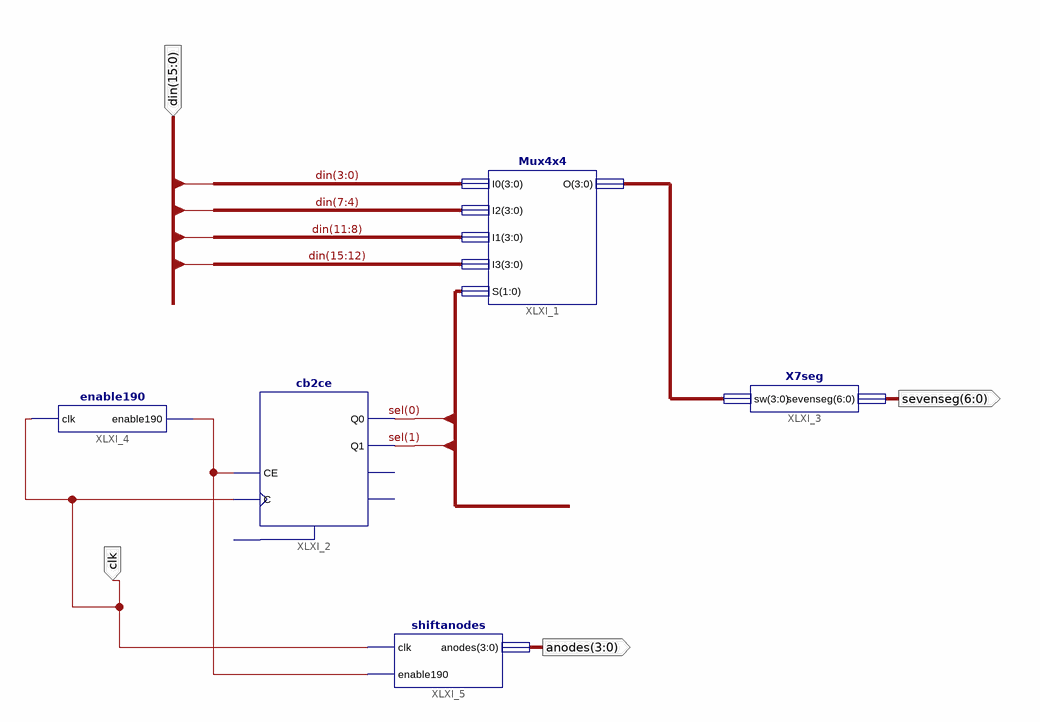
[diagram p0: schematic sheet 1]
// Xilinx ISE schematic afficheur.sch (spartan6) as structural Verilog: 5 symbols, 4 ports
module afficheur (
  input  clk,
  input  [15:0] din,
  output [6:0] sevenseg,
  output [3:0] anodes
);

  wire XLXN_11;
  wire [1:0] sel;
  wire [3:0] XLXN_1;

  Mux4x4 XLXI_1 (.I0(din[3:0]), .I2(din[7:4]), .I1(din[11:8]), .I3(din[15:12]), .S(sel), .O(XLXN_1));
  cb2ce XLXI_2 (.C(clk), .CE(XLXN_11), .Q0(sel[0]), .Q1(sel[1]));  // open: CLR, CEO, TC
  X7seg XLXI_3 (.sw(XLXN_1), .sevenseg(sevenseg));
  enable190 XLXI_4 (.clk(clk), .enable190(XLXN_11));
  shiftanodes XLXI_5 (.clk(clk), .enable190(XLXN_11), .anodes(anodes));
endmodule
